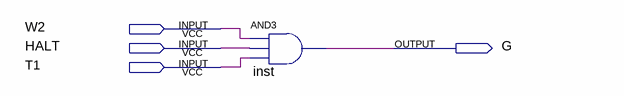
[diagram p0: schematic sheet]
// Quartus schematic G.bdf as structural Verilog: 1 symbols, 4 pins
module G (
  input  W2,
  input  HALT,
  input  T1,
  output G
);

  and inst (G, W2, HALT, T1);
endmodule
